# Altium schematic sheet pnuematic board rev1.SchDoc
size A
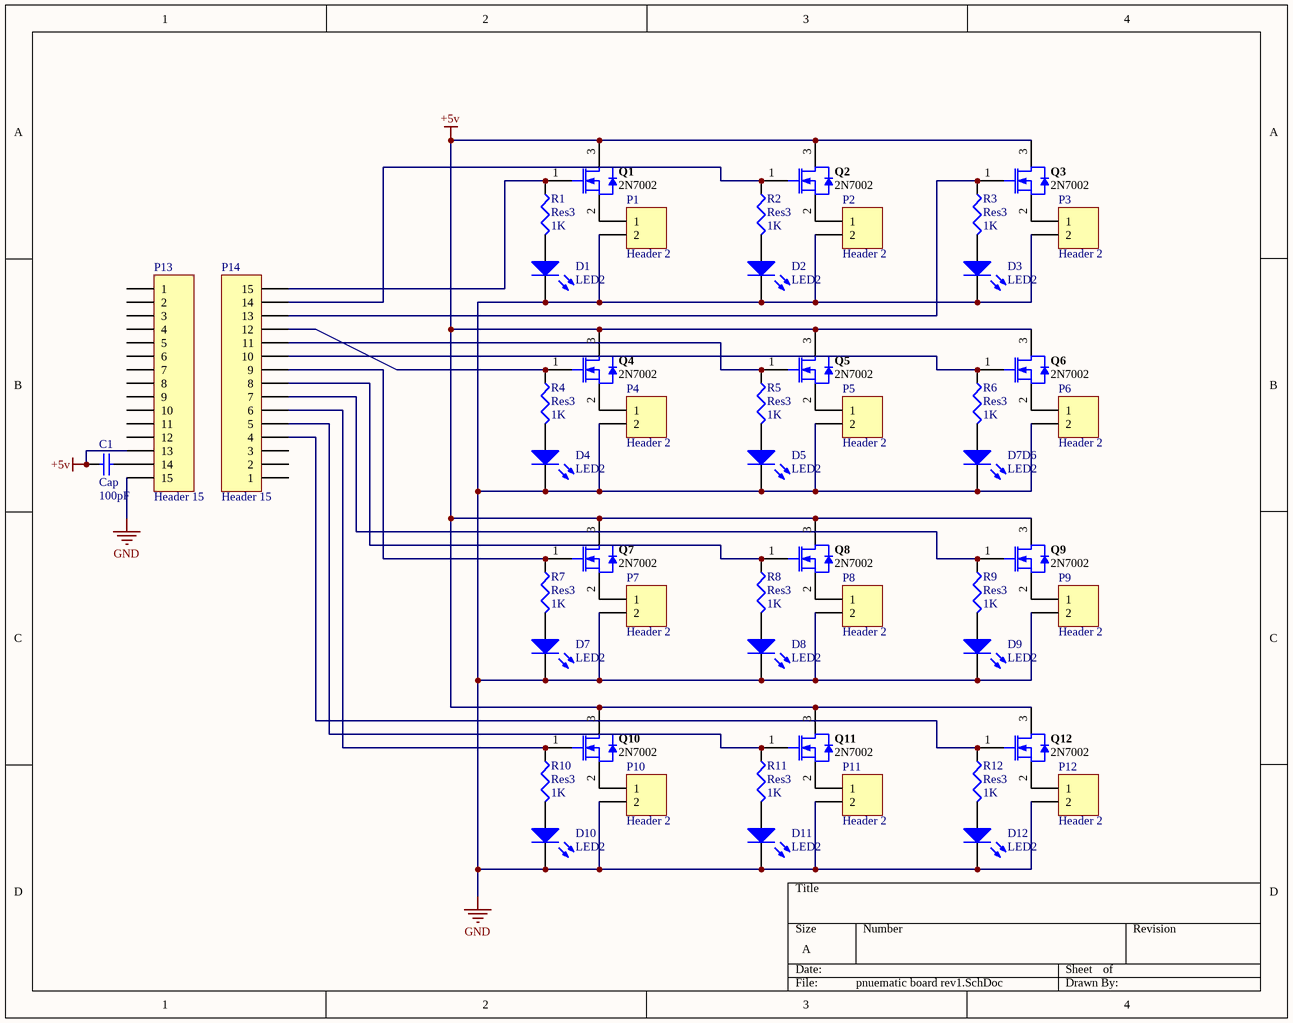
[diagram p0: pnuematic board rev1.SchDoc]

## Parts
C1  Cap  value 100pF  [RAD-0.3]
D1  LED2  [3.2X1.6X1.1]
D2  LED2  [3.2X1.6X1.1]
D3  LED2  [3.2X1.6X1.1]
D4  LED2  [3.2X1.6X1.1]
D5  LED2  [3.2X1.6X1.1]
D7  LED2  [3.2X1.6X1.1]
D7D6  LED2  [3.2X1.6X1.1]
D8  LED2  [3.2X1.6X1.1]
D9  LED2  [3.2X1.6X1.1]
D10  LED2  [3.2X1.6X1.1]
D11  LED2  [3.2X1.6X1.1]
D12  LED2  [3.2X1.6X1.1]
P1  Header 2  [HDR1X2]
P2  Header 2  [HDR1X2]
P3  Header 2  [HDR1X2]
P4  Header 2  [HDR1X2]
P5  Header 2  [HDR1X2]
P6  Header 2  [HDR1X2]
P7  Header 2  [HDR1X2]
P8  Header 2  [HDR1X2]
P9  Header 2  [HDR1X2]
P10  Header 2  [HDR1X2]
P11  Header 2  [HDR1X2]
P12  Header 2  [HDR1X2]
P13  Header 15  [HDR1X15]
P14  Header 15  [HDR1X15]
Q1  2N7002  [INF-PG-SOT23_N]
Q2  2N7002  [INF-PG-SOT23_N]
Q3  2N7002  [INF-PG-SOT23_N]
Q4  2N7002  [INF-PG-SOT23_N]
Q5  2N7002  [INF-PG-SOT23_N]
Q6  2N7002  [INF-PG-SOT23_N]
Q7  2N7002  [INF-PG-SOT23_N]
Q8  2N7002  [INF-PG-SOT23_N]
Q9  2N7002  [INF-PG-SOT23_N]
Q10  2N7002  [INF-PG-SOT23_N]
Q11  2N7002  [INF-PG-SOT23_N]
Q12  2N7002  [INF-PG-SOT23_N]
R1  Res3  value 1K  [J1-0603]
R2  Res3  value 1K  [J1-0603]
R3  Res3  value 1K  [J1-0603]
R4  Res3  value 1K  [J1-0603]
R5  Res3  value 1K  [J1-0603]
R6  Res3  value 1K  [J1-0603]
R7  Res3  value 1K  [J1-0603]
R8  Res3  value 1K  [J1-0603]
R9  Res3  value 1K  [J1-0603]
R10  Res3  value 1K  [J1-0603]
R11  Res3  value 1K  [J1-0603]
R12  Res3  value 1K  [J1-0603]

## Nets
+5v: C1.1 P13.13 Q1.3(DRAIN) Q2.3(DRAIN) Q3.3(DRAIN) Q4.3(DRAIN) Q5.3(DRAIN) Q6.3(DRAIN) Q7.3(DRAIN) Q8.3(DRAIN) Q9.3(DRAIN) Q10.3(DRAIN) Q11.3(DRAIN) Q12.3(DRAIN)
GND: D1.2(K) D2.2(K) D3.2(K) D4.2(K) D5.2(K) D7.2(K) D7D6.2(K) D8.2(K) D9.2(K) D10.2(K) D11.2(K) D12.2(K) P1.2 P2.2 P3.2 P4.2 P5.2 P6.2 P7.2 P8.2 P9.2 P10.2 P11.2 P12.2 P13.15
NetC1_2: C1.2 P13.14
NetP1_1: P1.1 Q1.2(SOURCE)
NetP2_1: P2.1 Q2.2(SOURCE)
NetP3_1: P3.1 Q3.2(SOURCE)
NetP4_1: P4.1 Q4.2(SOURCE)
NetP5_1: P5.1 Q5.2(SOURCE)
NetP6_1: P6.1 Q6.2(SOURCE)
NetP7_1: P7.1 Q7.2(SOURCE)
NetP8_1: P8.1 Q8.2(SOURCE)
NetP9_1: P9.1 Q9.2(SOURCE)
NetP10_1: P10.1 Q10.2(SOURCE)
NetP11_1: P11.1 Q11.2(SOURCE)
NetP12_1: P12.1 Q12.2(SOURCE)
NetP14_4: P14.4 Q12.1(GATE) R12.1
NetP14_5: P14.5 Q11.1(GATE) R11.1
NetP14_6: P14.6 Q10.1(GATE) R10.1
NetP14_7: P14.7 Q9.1(GATE) R9.1
NetP14_8: P14.8 Q8.1(GATE) R8.1
NetP14_9: P14.9 Q7.1(GATE) R7.1
NetP14_10: P14.10 Q6.1(GATE) R6.1
NetP14_11: P14.11 Q5.1(GATE) R5.1
NetP14_12: P14.12 Q4.1(GATE) R4.1
NetP14_13: P14.13 Q3.1(GATE) R3.1
NetP14_14: P14.14 Q2.1(GATE) R2.1
NetP14_15: P14.15 Q1.1(GATE) R1.1

Not connected (* = marked no-connect by the designer): D1 1(A); D2 1(A); D3 1(A); D4 1(A); D5 1(A); D7 1(A); D7D6 1(A); D8 1(A); D9 1(A); D10 1(A); D11 1(A); D12 1(A); P13 1 2 3 4 5 6 7 8 9 10 11 12; P14 1 2 3; R1 2; R2 2; R3 2; R4 2; R5 2; R6 2; R7 2; R8 2; R9 2; R10 2; R11 2; R12 2

## Library data of the parts
C1 = Cap: Capacitor; Published: 8-Jun-2000; LatestRevisionDate: 17-Jul-2002; LatestRevisionNote: Re-released for DXP Platform.; PackageReference: RAD-0.3; Publisher: Altium Limited; PackageDescription: Radial Cap, Thru-Hole; 2 Leads; 0.3 in Pin Spacing
D1-D5 D7 D7D6 D8-D12 = LED2: Typical RED, GREEN, YELLOW, AMBER GaAs LED; Published: 8-Jun-2000; LatestRevisionDate: 17-Jul-2002; LatestRevisionNote: Re-released for DXP Platform.; PackageReference: 3.2X1.6X1.1; Publisher: Altium Limited; PackageDescription: SM LED; 2 Flat Leads; PackageVersion: Feb-2002
P1-P12 = Header 2: Header, 2-Pin; LatestRevisionDate: 17-Jul-2002; LatestRevisionNote: Re-released for DXP Platform.; Publisher: Altium Limited
P13 P14 = Header 15: Header, 15-Pin; LatestRevisionDate: 17-Jul-2002; LatestRevisionNote: Re-released for DXP Platform.; Publisher: Altium Limited
Q1-Q12 = 2N7002: N-Channel OptiMOS Small-Signal-Transistor, 60 V VDS, 0.3 A ID, -55 to 150 degC, PG-SOT23, Reel, Green; Manufacturer: Infineon; Green: TRUE; ID (max): 0.3 A; IDpuls (max): 1.2 A; Ptot (max): 0.5 W; QG: 0.4 nC; RDS (on) (max): 3,000 mOhm; RDS (on) (max) (@4.5V): 4,000 mOhm; RthJA (max): 250 K/W; VDS (max): 60 V; VGS(th) (max): 2.5 V; VGS(th) (min): 1.5 V; PackageVersion: Apr-08; PackageReference: PG-SOT23; PackageDescription: 3-Pin Small Outline Transistor Package, 2.9 x 1.3 mm Body, 0.95 mm Pitch; DatasheetVersion: Rev. 2.4; Supplier 1: Arrow; Supplier Part Number 1: 6oGnorwKIcmhtwqcFeJ1owu1VFxg26S-d6kZGECfY84; Halogen-free: TRUE; Packing: Reel; Mounting Technology: Surface Mount; PartNumber: 2N7002; ComponentLink1Description: Manufacturer URL; ComponentLink1URL: http://www.infineon.com/; ComponentLink2Description: Datasheet; ComponentLink2URL: http://www.infineon.com/dgdl/2N7002_Rev2.4.pdf?folderId=db3a3043156fd573011622e10b5c1f67&fileId=db3a304319bc939a0119c2a9461e79e6; ComponentLink3Description: Package Specification; ComponentLink3URL: http://www.infineon.com/dgdl/SOT23-Package_Overview.pdf?folderId=db3a30431936bc4b0119532290053c66&fileId=db3a30431936bc4b0119533468123c85
R1-R12 = Res3: Resistor; Published: 8-Jun-2000; LatestRevisionDate: 29-May-2009; LatestRevisionNote: IPC-7351 Footprint Added.; PackageReference: J1-0603; Publisher: Altium Limited; PackageDescription: Chip Resistor